# EAGLE schematic testproject (EAGLE 9.6.2)
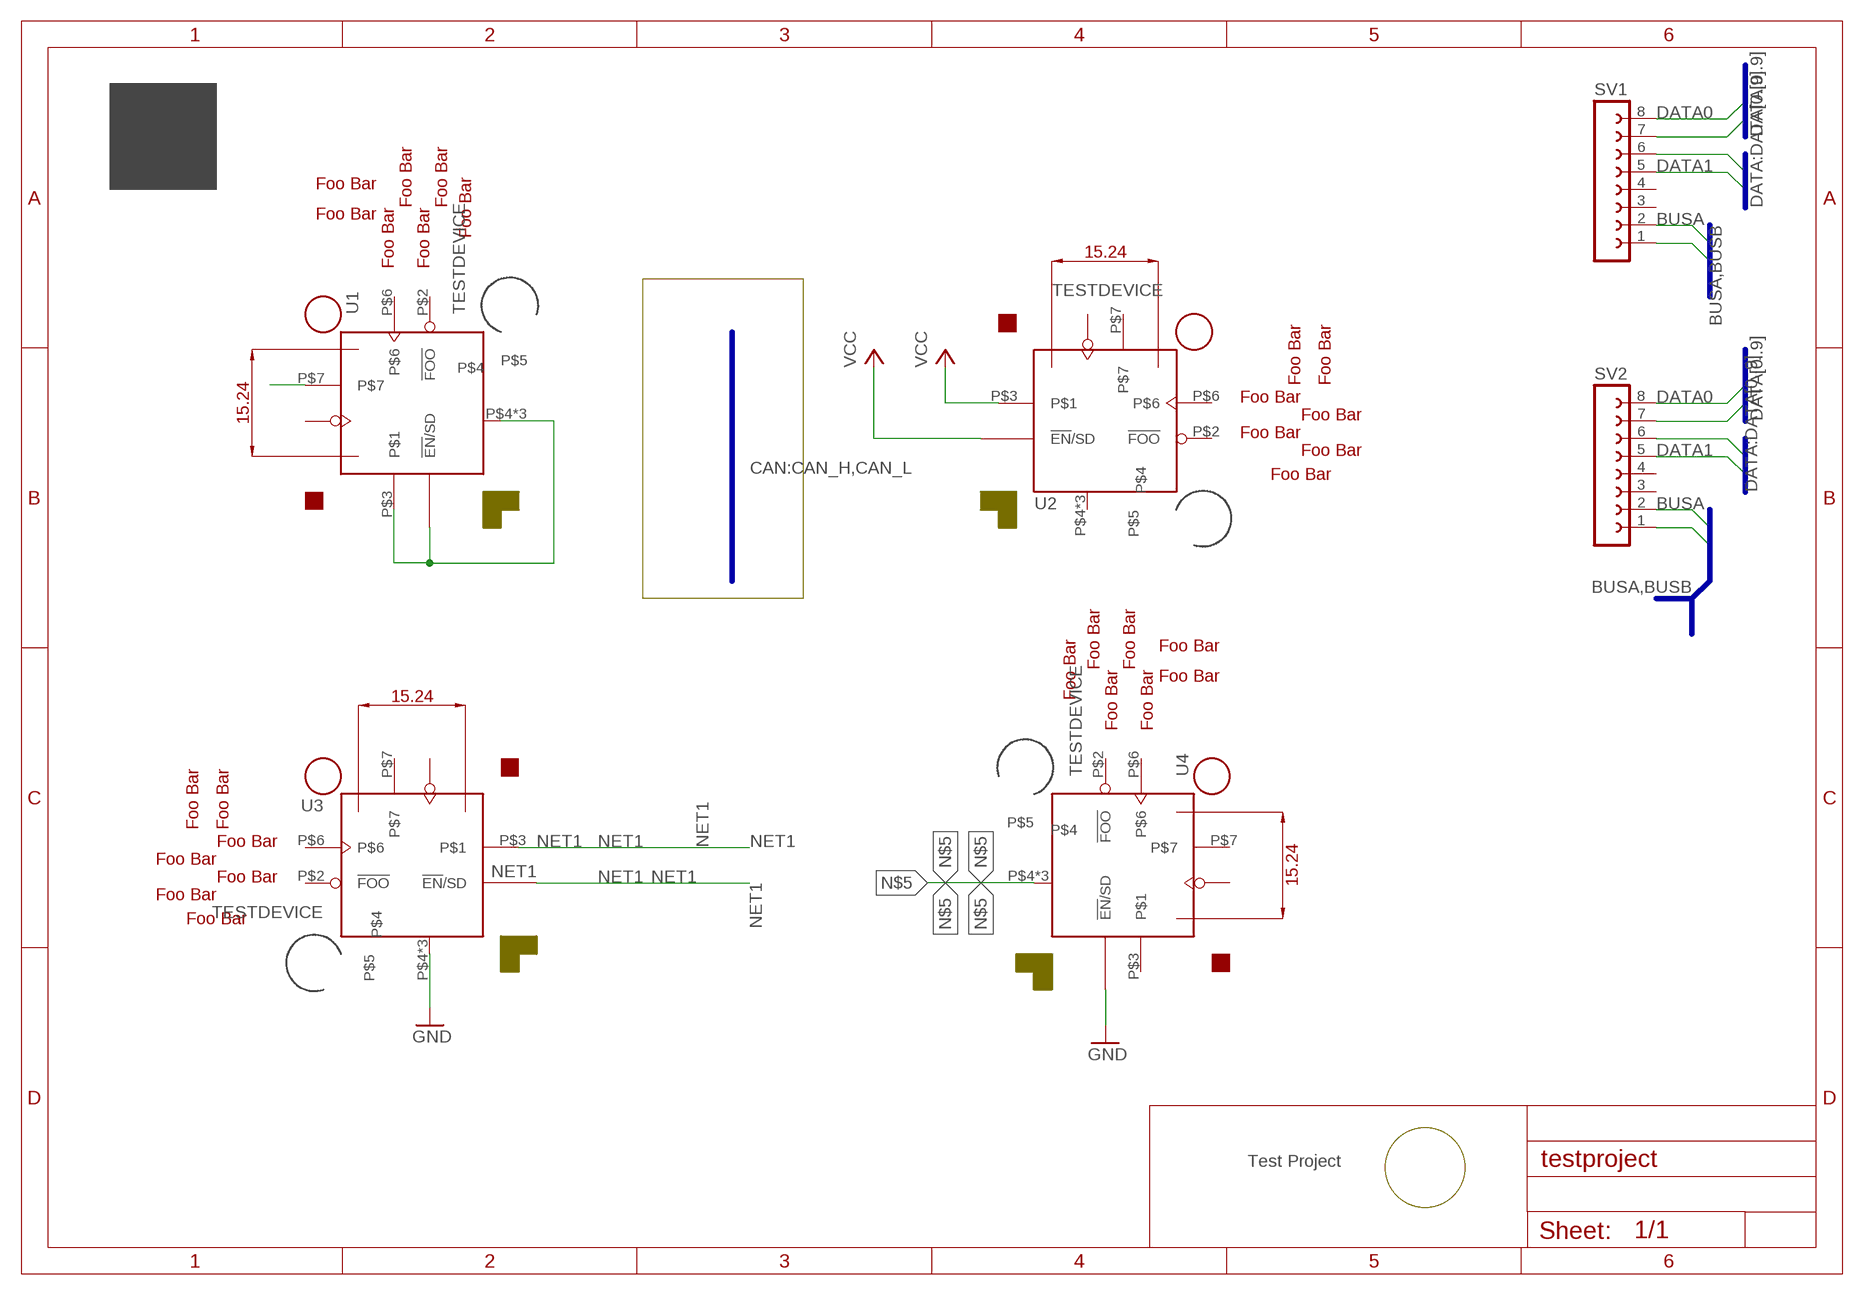
[diagram p0: schematic, sheet 1]

## Parts
SV1  FE08-1  [FE08]
SV2  FE08-1  [FE08]
U1  TESTDEVICE  [TESTPACKAGE]
U2  TESTDEVICE  [TESTPACKAGE]
U3  TESTDEVICE  [TESTPACKAGE]
U4  TESTDEVICE  [TESTPACKAGE]

## Nets
BUSA: SV1.2 SV2.2
BUSB: SV1.1 SV2.1
DATA0: SV1.6 SV1.8 SV2.6 SV2.8
DATA1: SV1.5 SV1.7 SV2.5 SV2.7
GND: U3.P$4 U3.P$13 U3.P$16 U4.P$1(!EN!/SD)
N$1: U1.P$1(!EN!/SD) U1.P$3 U1.P$4 U1.P$13 U1.P$16
N$2: U1.P$7
N$5: U4.P$4 U4.P$13 U4.P$16
NET1: U3.P$1(!EN!/SD) U3.P$3
VCC: U2.P$1(!EN!/SD) U2.P$3
Unconnected: SV1.3 SV1.4 SV2.3 SV2.4 U1.P$2(!FOO) U1.P$5 U1.P$6 U1.P$8 U1.P$9 U1.P$10 U2.P$2(!FOO) U2.P$4 U2.P$5 U2.P$6 U2.P$7 U2.P$8 U2.P$9 U2.P$10 U2.P$13 U2.P$16 U3.P$2(!FOO) U3.P$5 U3.P$6 U3.P$7 U3.P$8 U3.P$9 U3.P$10 U4.P$2(!FOO) U4.P$3 U4.P$5 U4.P$6 U4.P$7 U4.P$8 U4.P$9 U4.P$10

## Buses
CAN:CAN_H,CAN_L
DATA[0..9]
DATA:DATA[0..9]
BUSA,BUSB

## Notes on the sheet
- Test Project

## Library data of the parts
SV1 SV2 = con-lsta:FE08-1: FEMALE HEADER; OC_FARNELL: unknown; OC_NEWARK: unknown
U1-U4 = librepcb:TESTDEVICE: A test device